# Altium schematic sheet OpenRing_Debug.SchDoc
size A4; Size: A4; SheetNumber: 7; SheetTotal: 9
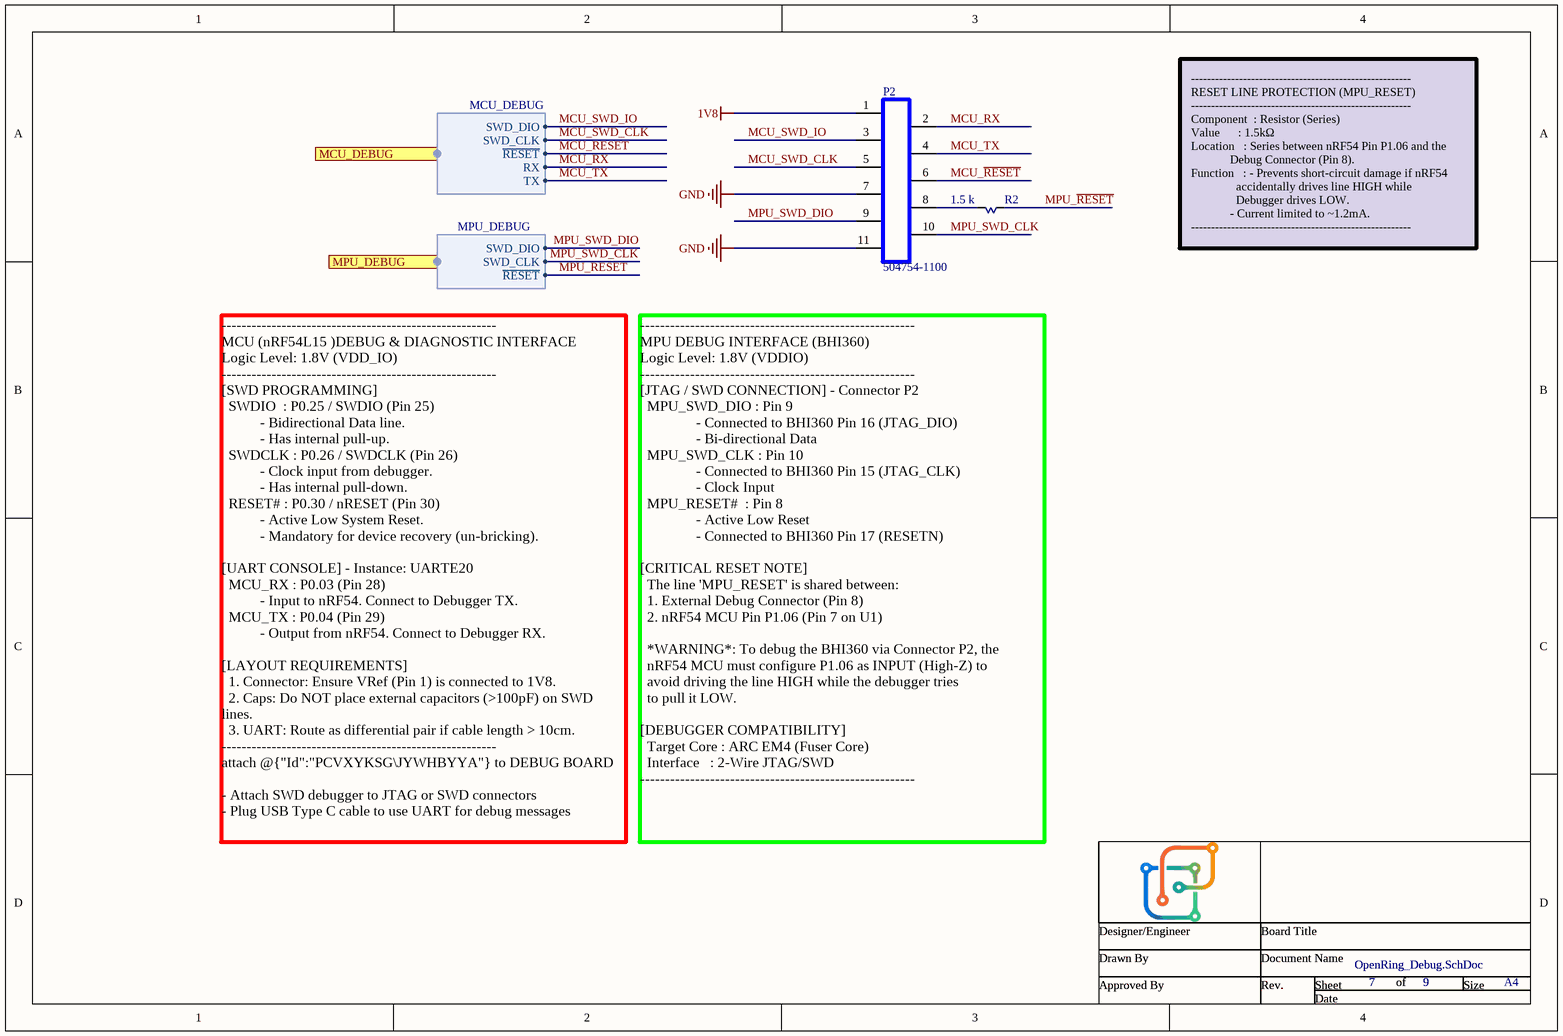
[diagram p0: OpenRing_Debug.SchDoc]

## Parts
P2  504754-1100  [5047541100]
R2  1.5 k  [RESC1005X04N]

## Ports
MCU_DEBUG (harness MCU_DEBUG), MPU_DEBUG (harness MPU_DEBUG)

## Harnesses
MPU_DEBUG: SWD_DIO, SWD_CLK, ~{RESET}
MCU_DEBUG: SWD_DIO, SWD_CLK, ~{RESET}, RX, TX

## Nets
1V8: P2.1
GND: P2.7 P2.11
MCU_~{RESET}: P2.6 ; port MCU_DEBUG.~{RESET}
MCU_RX: P2.2 ; port MCU_DEBUG.RX
MCU_SWD_CLK: P2.5 ; port MCU_DEBUG.SWD_CLK
MCU_SWD_IO: P2.3 ; port MCU_DEBUG.SWD_DIO
MCU_TX: P2.4 ; port MCU_DEBUG.TX
MPU_~{RESET}: R2.1 ; port MPU_DEBUG.~{RESET}
MPU_SWD_CLK: P2.10 ; port MPU_DEBUG.SWD_CLK
MPU_SWD_DIO: P2.9 ; port MPU_DEBUG.SWD_DIO
NetP2_8: P2.8 R2.2

## Notes on the sheet
- -------------------------------------------------------
  RESET LINE PROTECTION (MPU_RESET)
  -------------------------------------------------------
  Component  : Resistor (Series)
  Value      : 1.5kΩ
  Location   : Series between nRF54 Pin P1.06 and the
  Debug Connector (Pin 8).
  Function   : - Prevents short-circuit damage if nRF54
  accidentally drives line HIGH while
  Debugger drives LOW.
  - Current limited to ~1.2mA.
  -------------------------------------------------------
- -------------------------------------------------------
  MCU (nRF54L15 )DEBUG & DIAGNOSTIC INTERFACE
  Logic Level: 1.8V (VDD_IO)
  -------------------------------------------------------
  [SWD PROGRAMMING]
  SWDIO  : P0.25 / SWDIO (Pin 25)
  - Bidirectional Data line.
  - Has internal pull-up.
  SWDCLK : P0.26 / SWDCLK (Pin 26)
  - Clock input from debugger.
  - Has internal pull-down.
  RESET# : P0.30 / nRESET (Pin 30)
  - Active Low System Reset.
  - Mandatory for device recovery (un-bricking).
  [UART CONSOLE] - Instance: UARTE20
  MCU_RX : P0.03 (Pin 28)
  - Input to nRF54. Connect to Debugger TX.
  MCU_TX : P0.04 (Pin 29)
  - Output from nRF54. Connect to Debugger RX.
  [LAYOUT REQUIREMENTS]
  1. Connector: Ensure VRef (Pin 1) is connected to 1V8.
  2. Caps: Do NOT place external capacitors (>100pF) on SWD lines.
  3. UART: Route as differential pair if cable length > 10cm.
  -------------------------------------------------------
  attach @{"Id":"PCVXYKSG\JYWHBYYA"} to DEBUG BOARD
  - Attach SWD debugger to JTAG or SWD connectors
  - Plug USB Type C cable to use UART for debug messages
- -------------------------------------------------------
  MPU DEBUG INTERFACE (BHI360)
  Logic Level: 1.8V (VDDIO)
  -------------------------------------------------------
  [JTAG / SWD CONNECTION] - Connector P2
  MPU_SWD_DIO : Pin 9
  - Connected to BHI360 Pin 16 (JTAG_DIO)
  - Bi-directional Data
  MPU_SWD_CLK : Pin 10
  - Connected to BHI360 Pin 15 (JTAG_CLK)
  - Clock Input
  MPU_RESET#  : Pin 8
  - Active Low Reset
  - Connected to BHI360 Pin 17 (RESETN)
  [CRITICAL RESET NOTE]
  The line 'MPU_RESET' is shared between:
  1. External Debug Connector (Pin 8)
  2. nRF54 MCU Pin P1.06 (Pin 7 on U1)
  *WARNING*: To debug the BHI360 via Connector P2, the
  nRF54 MCU must configure P1.06 as INPUT (High-Z) to
  avoid driving the line HIGH while the debugger tries
  to pull it LOW.
  [DEBUGGER COMPATIBILITY]
  Target Core : ARC EM4 (Fuser Core)
  Interface   : 2-Wire JTAG/SWD
  -------------------------------------------------------
- Designer/Engineer
- Drawn By
- Document Name
- Board Title
- Sheet
- of
- Size
- A4
- Approved By
- Rev.
- Date

## Library data of the parts
P2 = 504754-1100: Conn FFC/FPC Connector SKT 11 POS 0.3mm Solder RA SMD Easy-On™ T/R; Manufacturer: Molex; CHECKED: FALSE; Supplier: Mouser; Supplier Part Number: 538-504754-1100; Manufacturer Part Number: 504754-1100; RoHS: No; Stock: 6459; Pricing: 1=0.77, 10=0.628, 50=0.544, 100=0.512, 1000=0.426, 10000=0.355 (USD); ComponentLink1URL: https://datasheet.octopart.com/504754-1100-Molex-datasheet-169278456.pdf?src-supplier=Farnell; ComponentLink1Description: https://datasheet.octopart.com/504754-1100-Molex-datasheet-169278456.pdf?src-supplier=Farnell; ComponentLink2URL: http://datasheet.octopart.com/5047541100-Molex-datasheet-38188796.pdf?src-supplier=Onlinecomponents.com; ComponentLink2Description: http://datasheet.octopart.com/5047541100-Molex-datasheet-38188796.pdf?src-supplier=Onlinecomponents.com; ComponentLink3URL: http://datasheet.octopart.com/5047541100-Molex-datasheet-38188796.pdf?src-supplier=Verical; ComponentLink3Description: http://datasheet.octopart.com/5047541100-Molex-datasheet-38188796.pdf?src-supplier=Verical; ComponentLink4URL: http://datasheet.octopart.com/5047541100-Molex-datasheet-38188796.pdf?src-supplier=Avnet; ComponentLink4Description: http://datasheet.octopart.com/5047541100-Molex-datasheet-38188796.pdf?src-supplier=Avnet; ComponentLink5URL: http://datasheet.octopart.com/5047541100-Molex-datasheet-38188796.pdf?src-supplier=TTI; ComponentLink5Description: http://datasheet.octopart.com/5047541100-Molex-datasheet-38188796.pdf?src-supplier=TTI; ComponentLink6URL: http://datasheet.octopart.com/5047541100-Molex-datasheet-38188796.pdf?src-supplier=Electro+Sonic; ComponentLink6Description: http://datasheet.octopart.com/5047541100-Molex-datasheet-38188796.pdf?src-supplier=Electro+Sonic; ComponentLink7URL: https://datasheet.octopart.com/504754-1100-Molex-datasheet-154754160.pdf?src-supplier=Master+Electronics; ComponentLink7Description: https://datasheet.octopart.com/504754-1100-Molex-datasheet-154754160.pdf?src-supplier=Master+Electronics; Supplier 1: Mouser; Supplier Part Number 1: 538-504754-1100
R2 = ERJ-2RKF1501X: RES SMD 1.5K OHM 1% 1/10W 0402; Manufacturer: Panasonic Electronic Components; Power (Watts): 0.1W, 1/10W; Temperature Coefficient: ±100ppm/°C; Supplier 1: Digi-Key; Manufacturer Part Number: ERJ-2RKF1501X; RoHS: RoHS Compliant; Category: Resistors; Stock 1: 1349197; Pricing 1: 1=0.1, 10=0.025, 25=0.018, 50=0.0136, 100=0.01, 250=0.00764, 500=0.00612, 1000=0.00451, 5000=0.00323 (USD); Packaging: Digi-Reel®; Part Status: Active; Resistance (Ohms): 1.5k; Tolerance: ±1%; Composition: Thick Film; Features: Automotive AEC-Q200; Operating Temperature: -55°C ~ 155°C; Package / Case: 0402 (1005 Metric); Supplier Device Package: 0402; Size / Dimension: 0.039" L x 0.020" W (1.00mm x 0.50mm); Height - Seated (Max): 0.016" (0.40mm); Number of Terminations: 2; Failure Rate: -; ComponentLink1URL: https://industrial.panasonic.com/cdbs/www-data/pdf/RDA0000/AOA0000C283.pdf; ComponentLink1Description: https://industrial.panasonic.com/cdbs/www-data/pdf/RDA0000/AOA0000C283.pdf; Supplier Part Number 1: P1.50KLDKR-ND; Value: 1.5 k